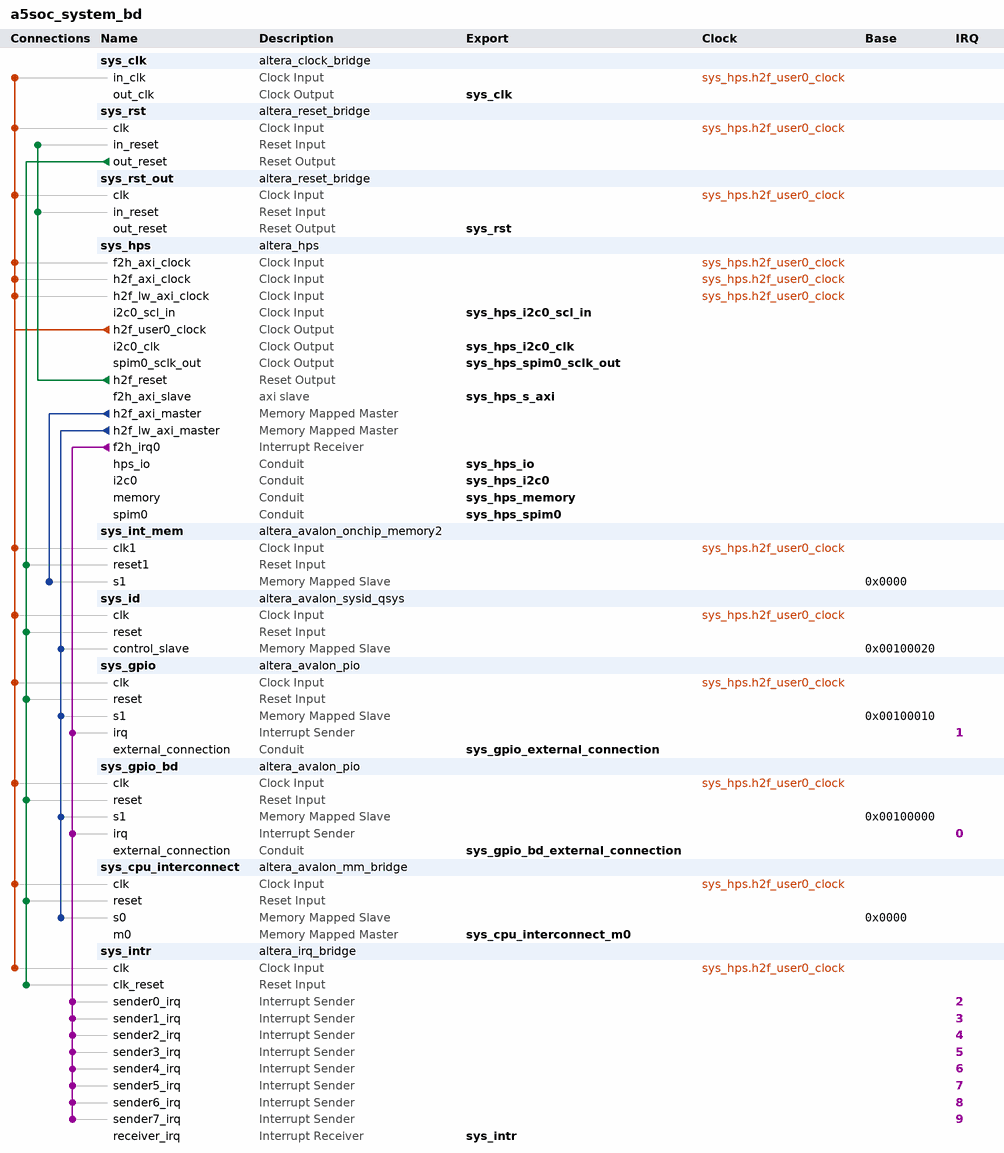
[diagram p0: system contents]
# Platform Designer (Qsys) system a5soc_system_bd, Arria V 5ASTFD5K3F40I3ES
# Parameters at their usual value, and those the tool derives, are not listed.
package require -exact qsys 15.1
create_system a5soc_system_bd
set_project_property DEVICE_FAMILY {Arria V}
set_project_property DEVICE 5ASTFD5K3F40I3ES

add_instance sys_clk altera_clock_bridge 15.1
set_instance_parameter_value sys_clk DERIVED_CLOCK_RATE 100000000
set_instance_parameter_value sys_clk EXPLICIT_CLOCK_RATE 50000000

add_instance sys_rst altera_reset_bridge 15.1
set_instance_parameter_value sys_rst ACTIVE_LOW_RESET 0
set_instance_parameter_value sys_rst SYNCHRONOUS_EDGES deassert

add_instance sys_rst_out altera_reset_bridge 15.1
set_instance_parameter_value sys_rst_out ACTIVE_LOW_RESET 0
set_instance_parameter_value sys_rst_out SYNCHRONOUS_EDGES deassert

add_instance sys_hps altera_hps 15.1
set_instance_parameter_value sys_hps EMAC1_Mode RGMII
set_instance_parameter_value sys_hps EMAC1_PinMuxing {HPS I/O Set 0}
set_instance_parameter_value sys_hps F2SCLK_COLDRST_Enable false
set_instance_parameter_value sys_hps F2SCLK_DBGRST_Enable false
set_instance_parameter_value sys_hps F2SCLK_WARMRST_Enable false
set_instance_parameter_value sys_hps F2SINTERRUPT_Enable true
set_instance_parameter_value sys_hps F2S_Width 2
set_instance_parameter_value sys_hps FPGA_PERIPHERAL_OUTPUT_CLOCK_FREQ_EMAC0_GTX_CLK 100
set_instance_parameter_value sys_hps FPGA_PERIPHERAL_OUTPUT_CLOCK_FREQ_EMAC0_MD_CLK 100.0
set_instance_parameter_value sys_hps FPGA_PERIPHERAL_OUTPUT_CLOCK_FREQ_EMAC1_GTX_CLK 100
set_instance_parameter_value sys_hps FPGA_PERIPHERAL_OUTPUT_CLOCK_FREQ_EMAC1_MD_CLK 100.0
set_instance_parameter_value sys_hps HPS_PROTOCOL DDR3
set_instance_parameter_value sys_hps I2C0_Mode Full
set_instance_parameter_value sys_hps I2C0_PinMuxing FPGA
set_instance_parameter_value sys_hps I2C1_Mode N/A
set_instance_parameter_value sys_hps I2C1_PinMuxing Unused
set_instance_parameter_value sys_hps LWH2F_Enable true
set_instance_parameter_value sys_hps MEM_BANKADDR_WIDTH 3
set_instance_parameter_value sys_hps MEM_CLK_FREQ 400.0
set_instance_parameter_value sys_hps MEM_COL_ADDR_WIDTH 10
set_instance_parameter_value sys_hps MEM_DQ_WIDTH 40
set_instance_parameter_value sys_hps MEM_DRV_STR RZQ/6
set_instance_parameter_value sys_hps MEM_ROW_ADDR_WIDTH 15
set_instance_parameter_value sys_hps MEM_RTT_NOM RZQ/4
set_instance_parameter_value sys_hps MEM_RTT_WR {Dynamic ODT off}
set_instance_parameter_value sys_hps MEM_TCL 7
set_instance_parameter_value sys_hps MEM_TFAW_NS 35.0
set_instance_parameter_value sys_hps MEM_TRAS_NS 35.0
set_instance_parameter_value sys_hps MEM_TRCD_NS 13.75
set_instance_parameter_value sys_hps MEM_TRFC_NS 260.0
set_instance_parameter_value sys_hps MEM_TRP_NS 13.75
set_instance_parameter_value sys_hps MEM_TRRD_NS 6.0
set_instance_parameter_value sys_hps MEM_VENDOR JEDEC
set_instance_parameter_value sys_hps MEM_WTCL 6
set_instance_parameter_value sys_hps QSPI_Mode {1 SS}
set_instance_parameter_value sys_hps QSPI_PinMuxing {HPS I/O Set 0}
set_instance_parameter_value sys_hps REF_CLK_FREQ 25.0
set_instance_parameter_value sys_hps S2FCLK_USER0CLK_Enable true
set_instance_parameter_value sys_hps S2FCLK_USER1CLK_FREQ 150.0
set_instance_parameter_value sys_hps S2FCLK_USER2CLK 4
set_instance_parameter_value sys_hps S2F_Width 2
set_instance_parameter_value sys_hps SDIO_Mode {4-bit Data}
set_instance_parameter_value sys_hps SDIO_PinMuxing {HPS I/O Set 0}
set_instance_parameter_value sys_hps SPIM0_Mode Full
set_instance_parameter_value sys_hps SPIM0_PinMuxing FPGA
set_instance_parameter_value sys_hps SPIM1_Mode N/A
set_instance_parameter_value sys_hps SPIM1_PinMuxing Unused
set_instance_parameter_value sys_hps STM_Enable false
set_instance_parameter_value sys_hps TIMING_BOARD_AC_SKEW 0.02
set_instance_parameter_value sys_hps TIMING_BOARD_AC_TO_CK_SKEW 0.0
set_instance_parameter_value sys_hps TIMING_BOARD_DQ_TO_DQS_SKEW 0.0
set_instance_parameter_value sys_hps TIMING_BOARD_MAX_CK_DELAY 0.6
set_instance_parameter_value sys_hps TIMING_BOARD_MAX_DQS_DELAY 0.6
set_instance_parameter_value sys_hps TIMING_BOARD_SKEW_BETWEEN_DQS 0.02
set_instance_parameter_value sys_hps TIMING_BOARD_SKEW_CKDQS_DIMM_MAX 0.01
set_instance_parameter_value sys_hps TIMING_BOARD_SKEW_CKDQS_DIMM_MIN -0.01
set_instance_parameter_value sys_hps TIMING_BOARD_SKEW_WITHIN_DQS 0.02
set_instance_parameter_value sys_hps TIMING_TDH 45
set_instance_parameter_value sys_hps TIMING_TDQSCK 225
set_instance_parameter_value sys_hps TIMING_TDQSQ 100
set_instance_parameter_value sys_hps TIMING_TDQSS 0.27
set_instance_parameter_value sys_hps TIMING_TDS 10
set_instance_parameter_value sys_hps TIMING_TDSH 0.18
set_instance_parameter_value sys_hps TIMING_TDSS 0.18
set_instance_parameter_value sys_hps TIMING_TIH 120
set_instance_parameter_value sys_hps TIMING_TIS 170
set_instance_parameter_value sys_hps TIMING_TQSH 0.4
set_instance_parameter_value sys_hps UART0_Mode {No Flow Control}
set_instance_parameter_value sys_hps UART0_PinMuxing {HPS I/O Set 1}
set_instance_parameter_value sys_hps USB1_Mode SDR
set_instance_parameter_value sys_hps USB1_PinMuxing {HPS I/O Set 0}
set_instance_parameter_value sys_hps desired_cfg_clk_mhz 100.0
set_instance_parameter_value sys_hps desired_qspi_clk_mhz 400.0
set_instance_parameter_value sys_hps use_default_mpu_clk false

add_instance sys_int_mem altera_avalon_onchip_memory2 15.1
set_instance_parameter_value sys_int_mem dataWidth 64
set_instance_parameter_value sys_int_mem dualPort false
set_instance_parameter_value sys_int_mem initMemContent true
set_instance_parameter_value sys_int_mem initializationFileName onchip_memory2_0
set_instance_parameter_value sys_int_mem memorySize 65536

add_instance sys_id altera_avalon_sysid_qsys 15.1
set_instance_parameter_value sys_id id -1395322095

add_instance sys_gpio altera_avalon_pio 15.1
set_instance_parameter_value sys_gpio bitClearingEdgeCapReg true
set_instance_parameter_value sys_gpio captureEdge true
set_instance_parameter_value sys_gpio direction InOut
set_instance_parameter_value sys_gpio edgeType FALLING
set_instance_parameter_value sys_gpio generateIRQ true
set_instance_parameter_value sys_gpio irqType EDGE
set_instance_parameter_value sys_gpio width 32

add_instance sys_gpio_bd altera_avalon_pio 15.1
set_instance_parameter_value sys_gpio_bd captureEdge true
set_instance_parameter_value sys_gpio_bd direction InOut
set_instance_parameter_value sys_gpio_bd edgeType FALLING
set_instance_parameter_value sys_gpio_bd generateIRQ true
set_instance_parameter_value sys_gpio_bd width 32

add_instance sys_cpu_interconnect altera_avalon_mm_bridge 15.1
set_instance_parameter_value sys_cpu_interconnect ADDRESS_UNITS SYMBOLS
set_instance_parameter_value sys_cpu_interconnect ADDRESS_WIDTH 20
set_instance_parameter_value sys_cpu_interconnect DATA_WIDTH 32
set_instance_parameter_value sys_cpu_interconnect MAX_PENDING_RESPONSES 4
set_instance_parameter_value sys_cpu_interconnect USE_AUTO_ADDRESS_WIDTH 0

add_instance sys_intr altera_irq_bridge 15.1
set_instance_parameter_value sys_intr IRQ_WIDTH 8

# connections
add_connection sys_hps.h2f_user0_clock sys_clk.in_clk clock
add_connection sys_hps.h2f_user0_clock sys_cpu_interconnect.clk clock
add_connection sys_hps.h2f_user0_clock sys_gpio.clk clock
add_connection sys_hps.h2f_user0_clock sys_gpio_bd.clk clock
add_connection sys_hps.h2f_user0_clock sys_hps.f2h_axi_clock clock
add_connection sys_hps.h2f_user0_clock sys_hps.h2f_axi_clock clock
add_connection sys_hps.h2f_user0_clock sys_hps.h2f_lw_axi_clock clock
add_connection sys_hps.h2f_user0_clock sys_id.clk clock
add_connection sys_hps.h2f_user0_clock sys_int_mem.clk1 clock
add_connection sys_hps.h2f_user0_clock sys_intr.clk clock
add_connection sys_hps.h2f_user0_clock sys_rst.clk clock
add_connection sys_hps.h2f_user0_clock sys_rst_out.clk clock
add_connection sys_hps.h2f_reset sys_rst.in_reset reset
add_connection sys_hps.h2f_reset sys_rst_out.in_reset reset
add_connection sys_rst.out_reset sys_cpu_interconnect.reset reset
add_connection sys_rst.out_reset sys_gpio.reset reset
add_connection sys_rst.out_reset sys_gpio_bd.reset reset
add_connection sys_rst.out_reset sys_id.reset reset
add_connection sys_rst.out_reset sys_int_mem.reset1 reset
add_connection sys_rst.out_reset sys_intr.clk_reset reset
add_connection sys_hps.h2f_axi_master sys_int_mem.s1 avalon
set_connection_parameter_value sys_hps.h2f_axi_master/sys_int_mem.s1 baseAddress 0x0000
add_connection sys_hps.h2f_lw_axi_master sys_cpu_interconnect.s0 avalon
set_connection_parameter_value sys_hps.h2f_lw_axi_master/sys_cpu_interconnect.s0 baseAddress 0x0000
add_connection sys_hps.h2f_lw_axi_master sys_gpio.s1 avalon
set_connection_parameter_value sys_hps.h2f_lw_axi_master/sys_gpio.s1 baseAddress 0x00100010
add_connection sys_hps.h2f_lw_axi_master sys_gpio_bd.s1 avalon
set_connection_parameter_value sys_hps.h2f_lw_axi_master/sys_gpio_bd.s1 baseAddress 0x00100000
add_connection sys_hps.h2f_lw_axi_master sys_id.control_slave avalon
set_connection_parameter_value sys_hps.h2f_lw_axi_master/sys_id.control_slave baseAddress 0x00100020
add_connection sys_hps.f2h_irq0 sys_gpio.irq interrupt
set_connection_parameter_value sys_hps.f2h_irq0/sys_gpio.irq irqNumber 1
add_connection sys_hps.f2h_irq0 sys_gpio_bd.irq interrupt
set_connection_parameter_value sys_hps.f2h_irq0/sys_gpio_bd.irq irqNumber 0
add_connection sys_hps.f2h_irq0 sys_intr.sender0_irq interrupt
set_connection_parameter_value sys_hps.f2h_irq0/sys_intr.sender0_irq irqNumber 2
add_connection sys_hps.f2h_irq0 sys_intr.sender1_irq interrupt
set_connection_parameter_value sys_hps.f2h_irq0/sys_intr.sender1_irq irqNumber 3
add_connection sys_hps.f2h_irq0 sys_intr.sender2_irq interrupt
set_connection_parameter_value sys_hps.f2h_irq0/sys_intr.sender2_irq irqNumber 4
add_connection sys_hps.f2h_irq0 sys_intr.sender3_irq interrupt
set_connection_parameter_value sys_hps.f2h_irq0/sys_intr.sender3_irq irqNumber 5
add_connection sys_hps.f2h_irq0 sys_intr.sender4_irq interrupt
set_connection_parameter_value sys_hps.f2h_irq0/sys_intr.sender4_irq irqNumber 6
add_connection sys_hps.f2h_irq0 sys_intr.sender5_irq interrupt
set_connection_parameter_value sys_hps.f2h_irq0/sys_intr.sender5_irq irqNumber 7
add_connection sys_hps.f2h_irq0 sys_intr.sender6_irq interrupt
set_connection_parameter_value sys_hps.f2h_irq0/sys_intr.sender6_irq irqNumber 8
add_connection sys_hps.f2h_irq0 sys_intr.sender7_irq interrupt
set_connection_parameter_value sys_hps.f2h_irq0/sys_intr.sender7_irq irqNumber 9

# exported interfaces
add_interface sys_clk clock source
set_interface_property sys_clk EXPORT_OF sys_clk.out_clk
add_interface sys_cpu_interconnect_m0 avalon master
set_interface_property sys_cpu_interconnect_m0 EXPORT_OF sys_cpu_interconnect.m0
add_interface sys_gpio_bd_external_connection conduit end
set_interface_property sys_gpio_bd_external_connection EXPORT_OF sys_gpio_bd.external_connection
add_interface sys_gpio_external_connection conduit end
set_interface_property sys_gpio_external_connection EXPORT_OF sys_gpio.external_connection
add_interface sys_hps_i2c0 conduit end
set_interface_property sys_hps_i2c0 EXPORT_OF sys_hps.i2c0
add_interface sys_hps_i2c0_clk clock source
set_interface_property sys_hps_i2c0_clk EXPORT_OF sys_hps.i2c0_clk
add_interface sys_hps_i2c0_scl_in clock sink
set_interface_property sys_hps_i2c0_scl_in EXPORT_OF sys_hps.i2c0_scl_in
add_interface sys_hps_io conduit end
set_interface_property sys_hps_io EXPORT_OF sys_hps.hps_io
add_interface sys_hps_memory conduit end
set_interface_property sys_hps_memory EXPORT_OF sys_hps.memory
add_interface sys_hps_s_axi axi slave
set_interface_property sys_hps_s_axi EXPORT_OF sys_hps.f2h_axi_slave
add_interface sys_hps_spim0 conduit end
set_interface_property sys_hps_spim0 EXPORT_OF sys_hps.spim0
add_interface sys_hps_spim0_sclk_out clock source
set_interface_property sys_hps_spim0_sclk_out EXPORT_OF sys_hps.spim0_sclk_out
add_interface sys_intr interrupt receiver
set_interface_property sys_intr EXPORT_OF sys_intr.receiver_irq
add_interface sys_rst reset source
set_interface_property sys_rst EXPORT_OF sys_rst_out.out_reset

set_interconnect_requirement {$system} qsys_mm.clockCrossingAdapter FIFO
set_interconnect_requirement {$system} qsys_mm.insertDefaultSlave FALSE
set_interconnect_requirement {$system} qsys_mm.maxAdditionalLatency 2

save_system a5soc_system_bd.qsys
